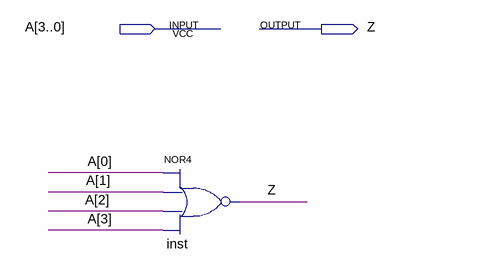
[diagram p0: schematic sheet]
// Quartus schematic ZERO_FLAG.bdf as structural Verilog: 1 symbols, 2 pins
module ZERO_FLAG (
  input  [3:0] A,
  output Z
);

  nor inst (Z, A[0], A[1], A[2], A[3]);
endmodule
